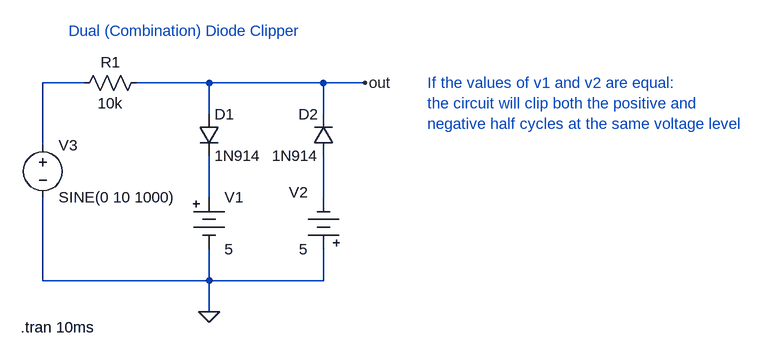
[diagram p0: schematic Dual Combination diode clipper.asc]
Dual Combination diode clipper.asc, the LTspice schematic file:
Version 4
SHEET 1 2076 680
WIRE 64 80 0 80
WIRE 256 80 144 80
WIRE 432 80 256 80
WIRE 496 80 432 80
WIRE 256 128 256 80
WIRE 432 128 432 80
WIRE 0 176 0 80
WIRE 256 256 256 192
WIRE 432 256 432 192
WIRE 0 384 0 256
WIRE 256 384 256 336
WIRE 256 384 0 384
WIRE 432 384 432 336
WIRE 432 384 256 384
WIRE 256 432 256 384
FLAG 256 432 0
FLAG 496 80 out
SYMBOL res 160 64 R90
WINDOW 0 0 56 VBottom 2
WINDOW 3 32 56 VTop 2
SYMATTR InstName R1
SYMATTR Value 10k
SYMBOL diode 240 128 R0
SYMATTR InstName D1
SYMATTR Value 1N914
SYMBOL diode 448 192 R180
WINDOW 0 24 64 Left 2
WINDOW 3 24 0 Left 2
SYMATTR InstName D2
SYMATTR Value 1N914
SYMBOL Misc\\battery 256 240 R0
SYMATTR InstName V1
SYMATTR Value 5
SYMBOL Misc\\battery 432 352 R180
WINDOW 0 24 104 Left 2
WINDOW 3 24 16 Left 2
WINDOW 123 0 0 Left 2
WINDOW 39 0 0 Left 2
SYMATTR InstName V2
SYMATTR Value 5
SYMBOL voltage 0 160 R0
WINDOW 123 0 0 Left 2
WINDOW 39 0 0 Left 2
SYMATTR InstName V3
SYMATTR Value SINE(0 10 1000)
TEXT 40 0 Left 2 ;Dual (Combination) Diode Clipper
TEXT -34 456 Left 2 !.tran 10ms
TEXT 592 80 Left 2 ;If the values of v1 and v2 are equal: \nthe circuit will clip both the positive and\nnegative half cycles at the same voltage level

The netlist it stands for:
* Dual Combination diode clipper.asc
R1 out N001 10k
D1 out N002 1N914
D2 N003 out 1N914
V1 N002 0 5
V2 0 N003 5
V3 N001 0 SINE(0 10 1000)
.model D D
.lib standard.dio
* Dual (Combination) Diode Clipper
.tran 10ms
* If the values of v1 and v2 are equal:
* the circuit will clip both the positive and
* negative half cycles at the same voltage level
.backanno
.end